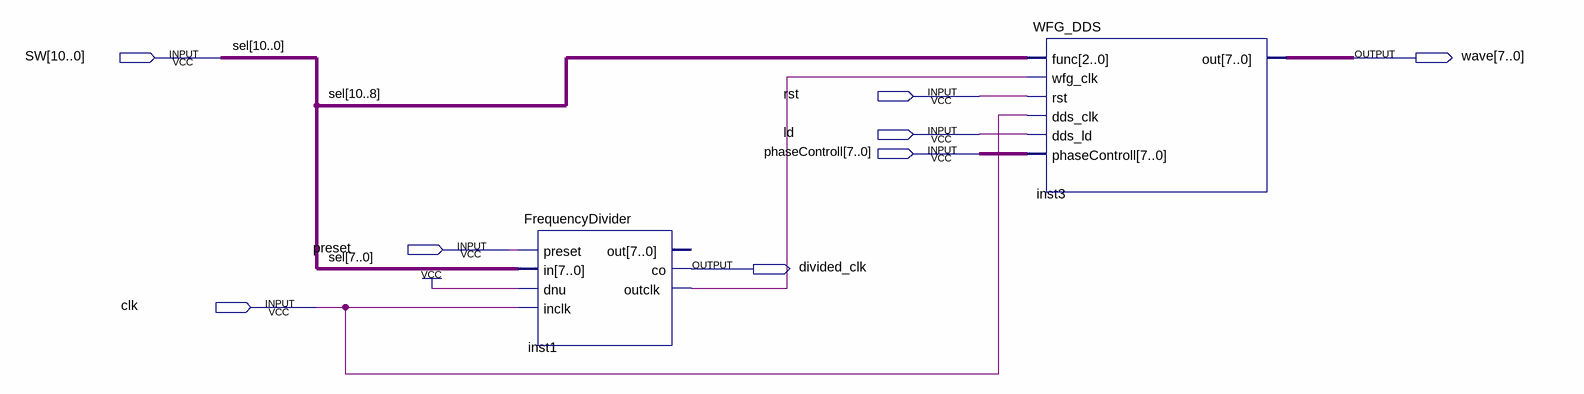
[diagram p0: schematic sheet]
// Quartus schematic WFG_DDS_FS.bdf as structural Verilog: 2 symbols, 8 pins
module WFG_DDS_FS (
  input  [10:0] SW,
  input  rst,
  input  ld,
  input  [7:0] phaseControll,
  input  preset,
  input  clk,
  output [7:0] wave,
  output divided_clk
);

  wire inst1_outclk;

  FrequencyDivider inst1 (
    .preset(preset), .in(SW[7:0]), .dnu(1'b1), .inclk(clk), .co(divided_clk), .outclk(inst1_outclk));  // open: out
  WFG_DDS inst3 (
    .func(SW[10:8]), .wfg_clk(inst1_outclk), .rst(rst), .dds_clk(clk), .dds_ld(ld),
    .phaseControll(phaseControll), .out(wave));

  // Other names for the same wires on the sheet: sel[10:0] = SW
endmodule
